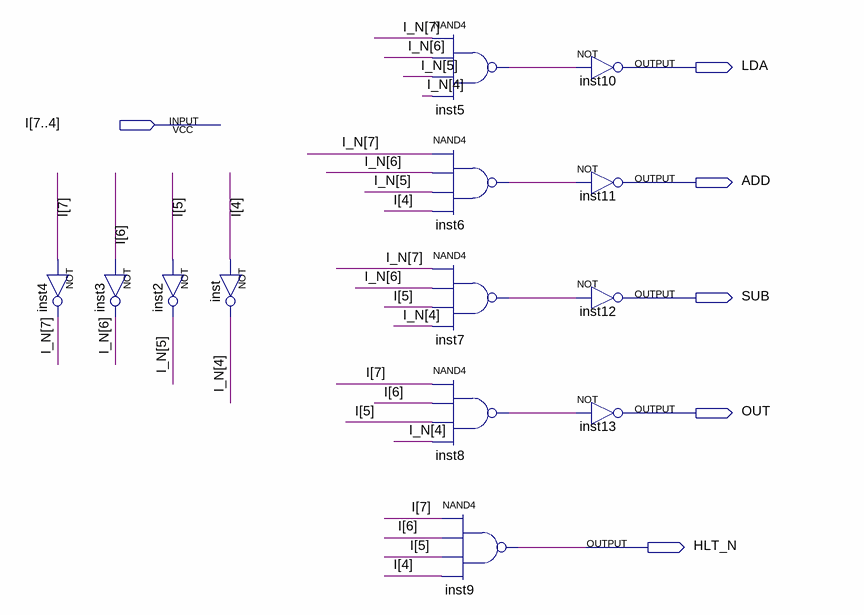
[diagram p0: schematic sheet]
// Quartus schematic INSTRUCTION_DECODER.bdf as structural Verilog: 13 symbols, 6 pins
module INSTRUCTION_DECODER (
  input  [7:4] I,
  output LDA,
  output ADD,
  output SUB,
  output OUT,
  output HLT_N
);

  wire inst5_out, inst6_out, inst7_out, inst8_out;
  wire [7:4] I_N;

  not inst4 (I_N[7], I[7]);
  not inst2 (I_N[5], I[5]);
  not inst3 (I_N[6], I[6]);
  not inst (I_N[4], I[4]);
  nand inst5 (inst5_out, I_N[7], I_N[6], I_N[5], I_N[4]);
  nand inst6 (inst6_out, I_N[7], I_N[6], I_N[5], I[4]);
  nand inst7 (inst7_out, I_N[7], I_N[6], I[5], I_N[4]);
  nand inst8 (inst8_out, I[7], I[6], I[5], I_N[4]);
  nand inst9 (HLT_N, I[7], I[6], I[5], I[4]);
  not inst10 (LDA, inst5_out);
  not inst11 (ADD, inst6_out);
  not inst12 (SUB, inst7_out);
  not inst13 (OUT, inst8_out);
endmodule
